# EAGLE schematic master-board plus slave (EAGLE 9.0.1)
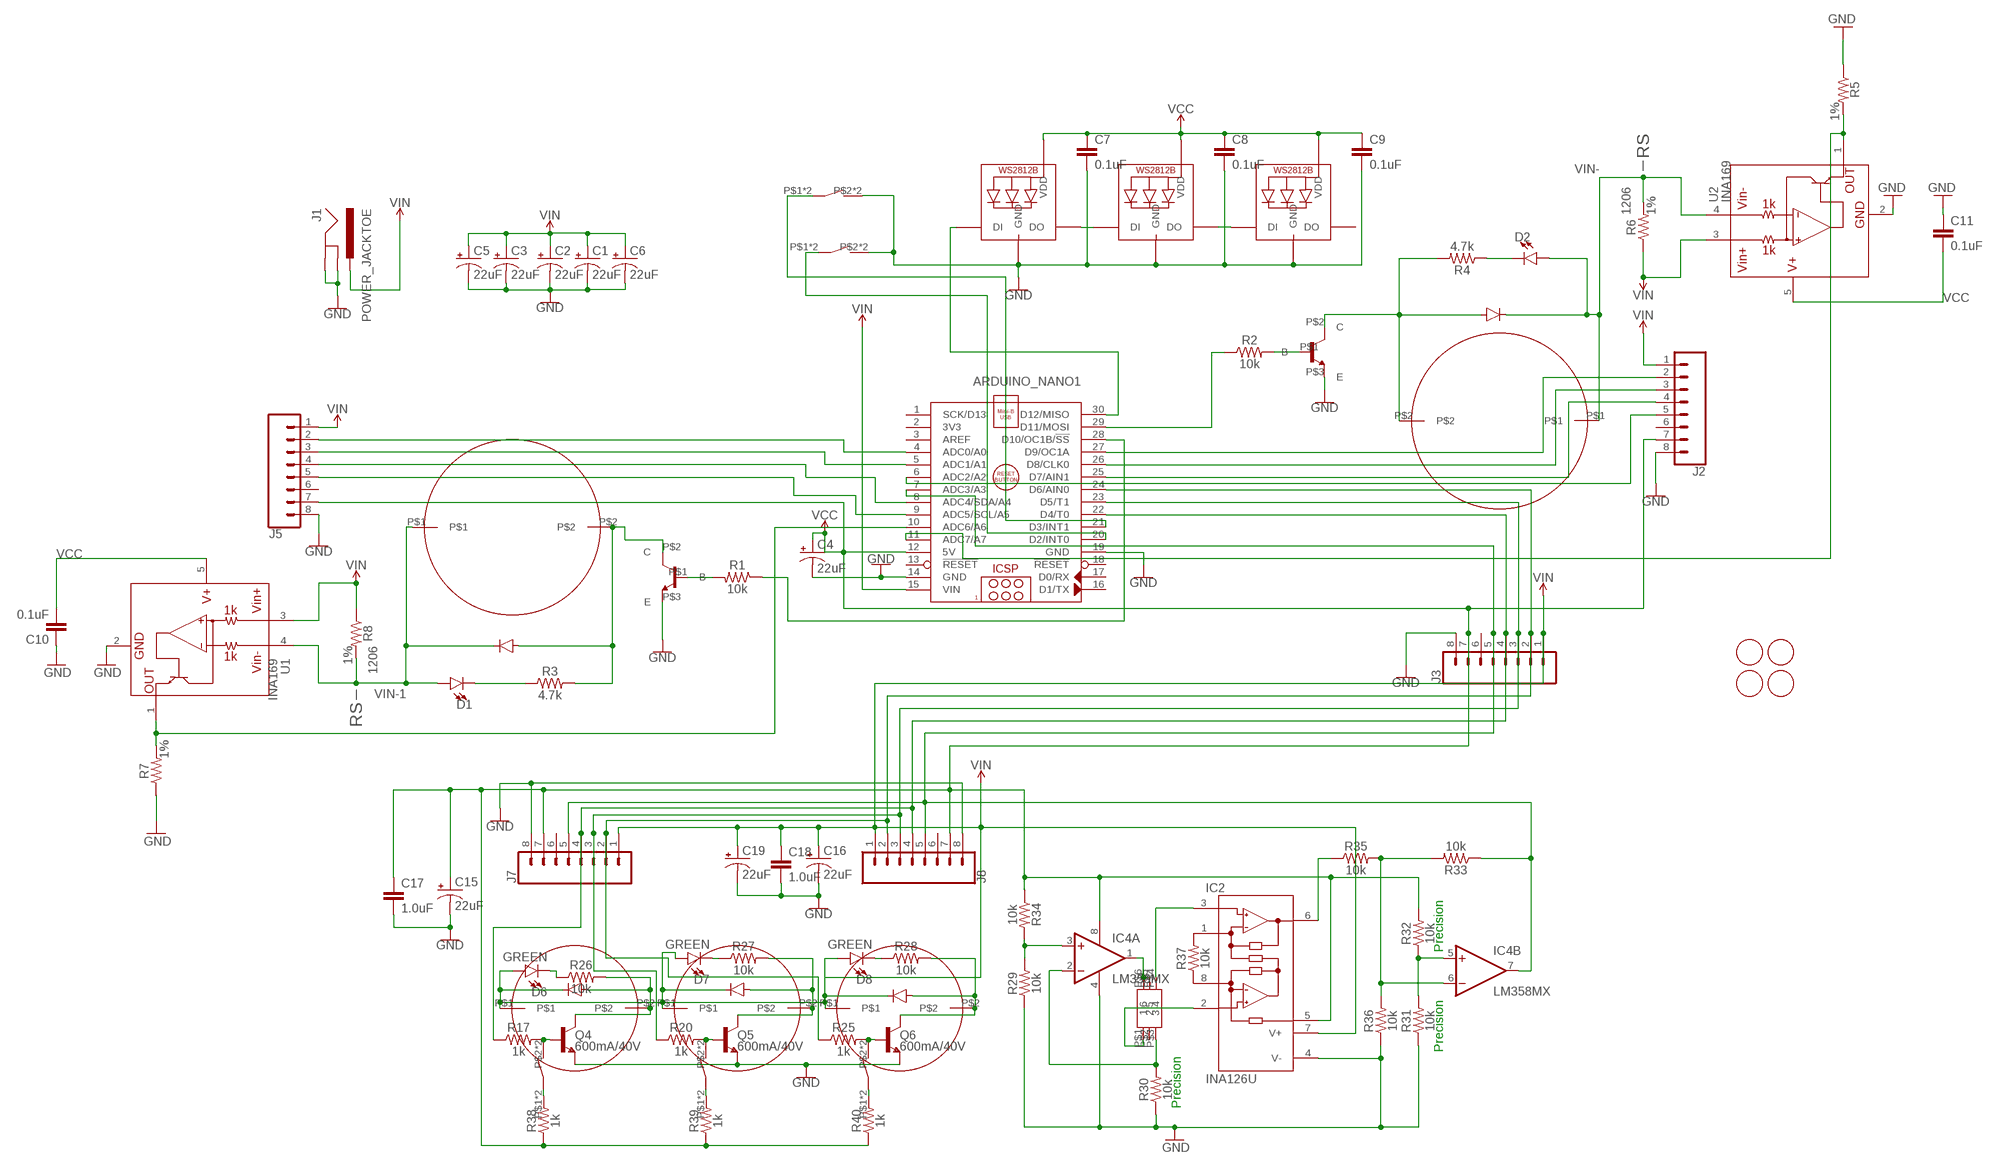
[diagram p0: schematic, sheet 1]

## Parts
ARDUINO_NANO1  ARDUINO_NANO  [ARDUINO_NANO]
C1  22uF  22UF-POLAR-PANASONIC_C-35V-20%  [PANASONIC_C]
C2  22uF  22UF-POLAR-PANASONIC_C-35V-20%  [PANASONIC_C]
C3  22uF  22UF-POLAR-PANASONIC_C-35V-20%  [PANASONIC_C]
C4  22uF  22UF-POLAR-PANASONIC_C-35V-20%  [PANASONIC_C]
C5  22uF  22UF-POLAR-PANASONIC_C-35V-20%  [PANASONIC_C]
C6  22uF  22UF-POLAR-PANASONIC_C-35V-20%  [PANASONIC_C]
C7  0.1uF  0.1UF-0603-25V-(+80/-20%)  [0603]
C8  0.1uF  0.1UF-0603-25V-(+80/-20%)  [0603]
C9  0.1uF  0.1UF-0603-25V-(+80/-20%)  [0603]
C10  0.1uF  CAP0603-CAP  [0603-CAP]
C11  0.1uF  CAP0603-CAP  [0603-CAP]
C15  22uF  22UF-POLAR-PANASONIC_C-35V-20%  [PANASONIC_C]
C16  22uF  22UF-POLAR-PANASONIC_C-35V-20%  [PANASONIC_C]
C17  1.0uF  1.0UF-0603-16V-10%  [0603]
C18  1.0uF  1.0UF-0603-16V-10%  [0603]
C19  22uF  22UF-POLAR-PANASONIC_C-35V-20%  [PANASONIC_C]
D1  LED0603  [LED-0603]
D2  LED0603  [LED-0603]
D6  GREEN  LED-GREEN0603  [LED-0603]
D7  GREEN  LED-GREEN0603  [LED-0603]
D8  GREEN  LED-GREEN0603  [LED-0603]
IC2  INA126U  [SO08]
IC4  LM358MX  [SO08]
J1  POWER_JACKTOE  [POWER_JACK_SMD_OVERPASTE_TOE]
J2  CONN_08"  [1X08]
J3  CONN_08"  [1X08]
J5  CONN_08"  [1X08]
J7  CONN_08"  [1X08]
J8  CONN_08"  [1X08]
LED1  WS2812B5050  [WS2812B]
LED2  WS2812B5050  [WS2812B]
LED3  WS2812B5050  [WS2812B]
Q4  600mA/40V  TRANS_NPN-MMBT2222AL  [SOT23-3]
Q5  600mA/40V  TRANS_NPN-MMBT2222AL  [SOT23-3]
Q6  600mA/40V  TRANS_NPN-MMBT2222AL  [SOT23-3]
R1  10k  10KOHM-0603-1/10W-1%  [0603]
R2  10k  10KOHM-0603-1/10W-1%  [0603]
R3  4.7k  4.7KOHM-0603-1/10W-1%  [0603]
R4  4.7k  4.7KOHM-0603-1/10W-1%  [0603]
R5  RESISTOR0603  [0603]
R6  RESISTOR1206  [1206]
R7  RESISTOR0603  [0603]
R8  RESISTOR1206  [1206]
R17  1k  1KOHM-0603-1/10W-1%  [0603]
R20  1k  1KOHM-0603-1/10W-1%  [0603]
R25  1k  1KOHM-0603-1/10W-1%  [0603]
R26  10k  10KOHM-0603-1/10W-1%  [0603]
R27  10k  10KOHM-0603-1/10W-1%  [0603]
R28  10k  10KOHM-0603-1/10W-1%  [0603]
R29  10k  10KOHM-0603-1/10W-1%  [0603]
R30  10k  10KOHM-0603-1/10W-1%  [0603]
R31  10k  10KOHM-0603-1/10W-1%  [0603]
R32  10k  10KOHM-0603-1/10W-1%  [0603]
R33  10k  10KOHM-0603-1/10W-1%  [0603]
R34  10k  10KOHM-0603-1/10W-1%  [0603]
R35  10k  10KOHM-0603-1/10W-1%  [0603]
R36  10k  10KOHM-0603-1/10W-1%  [0603]
R37  10k  10KOHM-0603-1/10W-1%  [0603]
R38  1k  1KOHM-0603-1/10W-1%  [0603]
R39  1k  1KOHM-0603-1/10W-1%  [0603]
R40  1k  1KOHM-0603-1/10W-1%  [0603]
U1  INA169  [SOT23-5]
U2  INA169  [SOT23-5]
U$1  AIYIMA-PUMP-A5F083  [A5F083]
U$2  AIYIMA-PUMP-A5F083  [A5F083]
U$3  IN4148  [IN4148]
U$4  IN4148  [IN4148]
U$5  TIP120-TO220  [TO220]
U$6  TIP120-TO220  [TO220]
U$7  BUTTON  [BUTTON]
U$8  BUTTON  [BUTTON]
U$9  FIDUCIAL  [FIDUCIAL_1MM]
U$10  FIDUCIAL  [FIDUCIAL_1MM]
U$11  FIDUCIAL  [FIDUCIAL_1MM]
U$12  FIDUCIAL  [FIDUCIAL_1MM]
U$17  CJV23-SOLENOID-VALVE  [CJV23]
U$18  CJV23-SOLENOID-VALVE  [CJV23]
U$19  CJV23-SOLENOID-VALVE  [CJV23]
U$20  IN4148  [IN4148]
U$21  IN4148  [IN4148]
U$22  IN4148  [IN4148]
U$23  2SMPP-03  [2SMPP-03]
U$24  BUTTON  [BUTTON]
U$25  BUTTON  [BUTTON]
U$26  BUTTON  [BUTTON]

## Nets
GND: ARDUINO_NANO1.14(GND) ARDUINO_NANO1.19(GND) C1.- C2.- C3.- C4.- C5.- C6.- C7.2 C8.2 C9.2 C10.1 C11.1 C15.- C16.- C17.2 C18.2 C19.- IC2.4(V-) IC4.4(P:V-) J1.GND(GNDBREAK) J1.P$4(GND) J2.8 J3.8 J5.8 J7.8 J8.8 LED1.3-GND(GND) LED2.3-GND(GND) LED3.3-GND(GND) Q4.2(E) Q5.2(E) Q6.2(E) R5.1 R7.1 R29.1 R30.1 R31.1 R36.1 U1.2(GND) U2.2(GND) U$5.P$3(E) U$6.P$3(E) U$7.P$2 U$7.P$4 U$8.P$2 U$8.P$4
N$1: ARDUINO_NANO1.29(D11/MOSI) R2.1
N$2: R1.2 U$6.P$1(B)
N$5: R3.2 U$1.P$2 U$3.P$2 U$6.P$2(C)
N$6: R4.2 U$2.P$2 U$4.P$2 U$5.P$2(C)
N$7: R2.2 U$5.P$1(B)
N$8: ARDUINO_NANO1.30(D12/MISO) LED1.4-DIN(DI)
N$10: ARDUINO_NANO1.28(D10/OC1B/!SS) R1.1
N$11: ARDUINO_NANO1.5(ADC1/A1) J5.3
N$12: D1.C R3.1
N$13: ARDUINO_NANO1.6(ADC2/A2) J2.5
N$14: ARDUINO_NANO1.9(ADC5/SCL/A5) J5.5
N$16: ARDUINO_NANO1.4(ADC0/A0) J5.2
N$17: D2.C R4.1
N$18: ARDUINO_NANO1.8(ADC4/SDA/A4) J5.4
N$20: ARDUINO_NANO1.20(D2/INT0) U$8.P$1 U$8.P$3
N$21: LED2.2-DOUT(DO) LED3.4-DIN(DI)
N$23: ARDUINO_NANO1.25(D7/AIN1) J2.4
N$24: ARDUINO_NANO1.26(D8/CLK0) J2.3
N$25: ARDUINO_NANO1.27(D9/OC1A) J2.2
N$26: LED1.2-DOUT(DO) LED2.4-DIN(DI)
N$29: ARDUINO_NANO1.21(D3/INT1) U$7.P$1 U$7.P$3
N$54: Q4.1(B) R17.2 U$24.P$2 U$24.P$4
N$55: Q5.1(B) R20.2 U$25.P$2 U$25.P$4
N$56: Q6.1(B) R25.2 U$26.P$2 U$26.P$4
N$57: Q6.3(C) R28.2 U$19.P$2 U$22.P$2
N$58: Q5.3(C) R27.2 U$18.P$2 U$21.P$2
N$59: Q4.3(C) R26.2 U$17.P$2 U$20.P$2
N$60: ARDUINO_NANO1.24(D6/AIN0) J3.2 J7.2 J8.2 R25.1
N$61: ARDUINO_NANO1.23(D5/T1) J3.3 J7.3 J8.3 R20.1
N$62: ARDUINO_NANO1.22(D4/T0) J3.4 J7.4 J8.4 R17.1
N$63: ARDUINO_NANO1.7(ADC3/A3) IC4.7(B:OUT) J3.5 J7.5 J8.5 R33.1
N$65: D8.C R28.1
N$66: D7.C R27.1
N$67: D6.C R26.1
N$68: IC2.2(-IN) U$23.P$1
N$69: IC4.1(A:OUT) U$23.P$5 U$23.P$6
N$70: IC2.3(+IN) U$23.P$4
N$71: IC4.3(A:+IN) R29.2 R34.2
N$72: IC2.8(RG) R37.1
N$73: IC2.1(RG) R37.2
N$74: IC4.6(B:-IN) R33.2 R35.2 R36.2
N$75: IC4.5(B:+IN) R31.2 R32.1
N$76: IC4.2(A:-IN) R30.2 U$23.P$3
N$77: IC2.6(OUT) R35.1
N$78: R38.2 U$24.P$1 U$24.P$3
N$79: R39.2 U$25.P$1 U$25.P$3
N$80: R40.2 U$26.P$1 U$26.P$3
VCC: ARDUINO_NANO1.12(5V) C4.+ C7.1 C8.1 C9.1 C10.2 C11.2 C15.+ C17.1 IC2.5(REF) IC4.8(P:V+) J2.7 J3.7 J5.7 J7.7 J8.7 LED1.1-VDD(VDD) LED2.1-VDD(VDD) LED3.1-VDD(VDD) R32.2 R34.1 R38.1 R39.1 R40.1 U1.5(V+) U2.5(V+)
VIN: ARDUINO_NANO1.15(VIN) C1.+ C2.+ C3.+ C5.+ C6.+ C16.+ C18.1 C19.+ D6.A D7.A D8.A IC2.7(V+) J1.VIN0(PWR) J2.1 J3.1 J5.1 J7.1 J8.1 R6.1 R8.1 U1.3(VIN+) U2.3(VIN+) U$17.P$1 U$18.P$1 U$19.P$1 U$20.P$1 U$21.P$1 U$22.P$1
VIN-: D2.A R6.2 U2.4(VIN-) U$2.P$1 U$4.P$1
VIN-1: D1.A R8.2 U1.4(VIN-) U$1.P$1 U$3.P$1
VOUT: ARDUINO_NANO1.10(ADC6/A6) R7.2 U1.1(OUT)
VOUT1: ARDUINO_NANO1.11(ADC7/A7) R5.2 U2.1(OUT)
Unconnected: ARDUINO_NANO1.1(SCK/D13) ARDUINO_NANO1.2(3V3) ARDUINO_NANO1.3(AREF) ARDUINO_NANO1.13(!RESET) ARDUINO_NANO1.16(D1/TX) ARDUINO_NANO1.17(D0/RX) ARDUINO_NANO1.18(!RESET) J2.6 J3.6 J5.6 J7.6 J8.6 LED3.2-DOUT(DO) U$23.P$2

## Notes on the sheet
- RS
- RS
- Precision
- Precision
- Precision

## Library data of the parts
ARDUINO_NANO1 = ArduinoNanoV30:ARDUINO_NANO: Arduino Nano V3.0 Module Overview: The Arduino Nano is a small, complete, and breadboard-friendly board based on the ATmega328 (Arduino Nano 3.x) or ATmega168 (Arduino Nano 2.x). It has more or less the same functionality of the Arduino Duemilanove, but in a different package. It lacks only a DC power jack, and works with a Mini-B USB cable instead of a standard one. The Nano was designed and is being produced by Gravitech <http://www.gravitech.us/arna30wiatp.html>. General specifications: Item Value Microcontroller Atmel ATmega168 or ATmega328 Operating Voltage (logic level) 5 V Input Voltage (recommended) 7-12 V Input Voltage (limits) 6-20 V Digital I/O Pins 14 (of which 6 provide PWM output) Analog Input Pins 8 DC Current per I/O Pin 40 mA Flash Memory 16 KB (ATmega168) or 32 KB (ATmega328) of which 2 KB used by bootloader SRAM 1 KB (ATmega168) or 2 KB (ATmega328) EEPROM 512 bytes (ATmega168) or 1 KB (ATmega328) Clock Speed 16 MHz Dimensions (Inches) 0.73" x 1.70" Dimensions (mm) 18mm x 45mm Overall height About 9 mm (not including pins) Weigth 5 g Power: The Arduino Nano can be powered via the Mini-B USB connection, 6-20V unregulated external power supply (pin 30), or 5V regulated external power supply (pin 27). The power source is automatically selected to the highest voltage source. Memory: The ATmega168 has 16 KB of flash memory for storing code (of which 2 KB is used for the bootloader); the ATmega328 has 32 KB, (also with 2 KB used for the bootloader). The ATmega168 has 1 KB of SRAM and 512 bytes of EEPROM (which can be read and written with the EEPROM library); the ATmega328 has 2 KB of SRAM and 1 KB of EEPROM. Input and Output: Each of the 14 digital pins on the Nano can be used as an input or output, using pinMode(), digitalWrite(), and digitalRead() functions. They operate at 5 volts. Each pin can provide or receive a maximum of 40 mA and has an internal pull-up resistor (disconnected by default) of 20-50 kOhms. In addition, some pins have specialized functions. Visit Arduino - ArduinoBoardNano <https://www.arduino.cc/en/Main/ArduinoBoardNano>
C1-C6 C15 C16 C19 = SparkFun-Capacitors:22UF-POLAR: 22µF polarized capacitors A capacitor is a passive two-terminal electrical component used to store electrical energy temporarily in an electric field.; PROD_ID: CAP-08618
C7-C9 = SparkFun-Capacitors:0.1UF: 0.1µF ceramic capacitors A capacitor is a passive two-terminal electrical component used to store electrical energy temporarily in an electric field.; PROD_ID: CAP-00810
C10 C11 = SparkFun-Passives:CAP: Capacitor Standard 0603 ceramic capacitor, and 0.1" leaded capacitor.
C17 C18 = SparkFun-Capacitors:1.0UF: 1µF ceramic capacitors A capacitor is a passive two-terminal electrical component used to store electrical energy temporarily in an electric field.; PROD_ID: CAP-00868
D1 D2 = SparkFun-LED:LED: LED (Generic) Standard schematic elements and footprints for 5mm, 3mm, 1206, and 0603 sized LEDs. Generic LEDs with no color specified.
D6-D8 = SparkFun-LED:LED-GREEN: Green SMD LED Used in manufacturing of various products at SparkFun Packages: 0603 - SMD 0603 package [Product Link] <http://www.futureelectronics.com/en/technologies/semiconductors/optoelectronics/leds/Pages/9894312-LTST-C190GKT.aspx?CrossPart=HSMG-C190&IM=0> LilyPad 1206 - SMD1206 LilyPad package [Product Link] <http://www.futureelectronics.com/en/Technologies/Product.aspx?ProductID=IN150NGHARVATEKCORPORATION2049943&IM=0> 1206 - SMD1206 package [Product Link] <http://www.futureelectronics.com/en/technologies/semiconductors/optoelectronics/leds/Pages/8315665-LTST-C150KGKT.aspx?IM=0> 1206 Bottom Mount -SMD 1206 Bottom Mount [Product Link] <http://www.digikey.com/product-detail/en/lite-on-inc/LTST-C230KGKT/160-1456-1-ND/386854> SparkFun Products: Pro Mini 328 -5V <https://www.sparkfun.com/products/821> RedBoard <https://www.sparkfun.com/products/12757> MP3 Trigger <https://www.sparkfun.com/products/13720> Makey Makey <https://www.sparkfun.com/products/11076>; PROD_ID: DIO-00821
IC2 = INA126:INA126: Instrumentation Amplifier Micropower, Single and Dual Versions; AVAILABILITY: Unavailable; DESCRIPTION: the ina126 and ina2126 are precision instrumentation amplifiers for accurate low noise differential signal acquisitio...; MF: Texas Instruments; MP: INA126; PACKAGE: TSSOP-8 Texas Instruments; PRICE: None
IC4 = linear:LM358: OP AMP also LM158; LM258; LM2904 Source: http://cache.national.com/ds/LM/LM158.pdf
J1 = SparkFun-Connectors:POWER_JACK: Power Jack Connector This is the standard 5.5mm barrel jack for power. The PTH is the most common, proven, reliable, footprint. The Slot footprint only works if the mill layer is transmitted to the PCB fab house so be warned. Here are the connectors we sell at SparkFun: DC Barrel Power Jack/Connector <https://www.sparkfun.com/products/119> (PRT-00119) DC Barrel Power Jack/Connector (SMD) <https://www.sparkfun.com/products/12748> (PRT-12748) DC Barrel Jack Adapter - Breadboard Compatible <https://www.sparkfun.com/products/10811> (PRT-10811) It is used on this SparkFun product (and many, many others): SparkFun RedBoard - Programmed with Arduino <https://www.sparkfun.com/products/12757> (DEV-12757) Also, if you need a mating power supply or connector, please check these out: Wall Adapter Power Supply - 9VDC 650mA <https://www.sparkfun.com/products/298> (TOL-00298) DC Barrel Jack Adapter - Male <https://www.sparkfun.com/products/10287> (PRT-10287); PROD_ID: CONN-08106; SF_ID: PRT-12748
J2 J3 J5 J7 J8 = SparkFun-Connectors:CONN_08: Multi connection point. Often used as Generic Header-pin footprint for 0.1 inch spaced/style header connections On any of the 0.1 inch spaced packages, you can populate with these: Break Away Headers - Straight <https://www.sparkfun.com/products/116> (PRT-00116) Break Away Male Headers - Right Angle <https://www.sparkfun.com/products/553> (PRT-00553) Female Headers <https://www.sparkfun.com/products/115> (PRT-00115) Break Away Headers - Machine Pin <https://www.sparkfun.com/products/117> (PRT-00117) Break Away Female Headers - Swiss Machine Pin <https://www.sparkfun.com/products/743> (PRT-00743) Arduino Stackable Header - 8 Pin <https://www.sparkfun.com/products/9279> (PRT-09279) For SCREWTERMINALS and SPRING TERMINALS visit here: Screw Terimnals on SparkFun.com <https://www.sparkfun.com/search/results?term=Screw+Terminals> (5mm/3.5mm/2.54mm spacing) This device is also useful as a general connection point to wire up your design to another part of your project. Our various solder wires solder well into these plated through hole pads. Hook-Up Wire - Assortment (Stranded, 22 AWG) <https://www.sparkfun.com/products/11375> (PRT-11375) Hook-Up Wire - Assortment (Solid Core, 22 AWG) <https://www.sparkfun.com/products/11367> (PRT-11367) View the entire wire category on our website here <https://www.sparkfun.com/categories/141> Special notes: Molex polarized connector foot print use with SKU : PRT-08231 with associated crimp pins and housings. 1MM SMD Version SKU: PRT-10208 NOTES ON THE VARIANTS LOCK and LOCK_LONGPADS... This footprint was designed to help hold the alignment of a through-hole component (i.e. 6-pin header) while soldering it into place. You may notice that each hole has been shifted either up or down by 0.005 of an inch from it's more standard position (which is a perfectly straight line). This slight alteration caused the pins (the squares in the middle) to touch the edges of the holes. Because they are alternating, it causes a "brace" to hold the component in place. 0.005 has proven to be the perfect amount of "off-center" position when using our standard breakaway headers. Although looks a little odd when you look at the bare footprint, once you have a header in there, the alteration is very hard to notice. Also,if you push a header all the way into place, it is covered up entirely on the bottom side.; PROD_ID: CONN-08438
LED1-LED3 = adafruit:WS2812B
Q4-Q6 = SparkFun-DiscreteSemi:TRANS_NPN: NPN transistor Current controlled devices typically used to amplify current or used as a switch. BC547 - COM-08928 <http://www.sparkfun.com/products/8928> (TO-92 45V 100mA) (1.Collector 2.Base 3.Emitter) 2N3904 - COM-00521 <http://www.sparkfun.com/products/521> (TO-92 40V 200mA) (1.Emitter 2.Base 3.Collector) P2N2222A - COM-12852 <http://www.sparkfun.com/products/12852> (TO-92 40V 600mA) (1.Collector 2.Base 3.Emitter); PROD_ID: TRANS-08049
R1 R2 R26-R37 = SparkFun-Resistors:10KOHM: 10kΩ resistor A resistor is a passive two-terminal electrical component that implements electrical resistance as a circuit element. Resistors act to reduce current flow, and, at the same time, act to lower voltage levels within circuits. - Wikipedia; PROD_ID: RES-00824
R3 R4 = SparkFun-Resistors:4.7KOHM: 4.7kΩ resistor A resistor is a passive two-terminal electrical component that implements electrical resistance as a circuit element. Resistors act to reduce current flow, and, at the same time, act to lower voltage levels within circuits. - Wikipedia; PROD_ID: RES-07857
R5 R7 = SparkFun-Resistors:RESISTOR: Generic Resistor Package; TOL: 1%
R6 R8 = SparkFun-Resistors:RESISTOR: Generic Resistor Package; SIZE: 1206; TOL: 1%
R17 R20 R25 R38-R40 = SparkFun-Resistors:1KOHM: 1kΩ resistor A resistor is a passive two-terminal electrical component that implements electrical resistance as a circuit element. Resistors act to reduce current flow, and, at the same time, act to lower voltage levels within circuits. - Wikipedia; PROD_ID: RES-07856
U1 U2 = SparkFun-AnalogIC:INA169
U$1 U$2 = programmable-air-components:AIYIMA-PUMP-A5F083: Aiyima company vacuum/high pressure air pump. 12V, 0.35A, 3LPM
U$3 U$4 U$20-U$22 = programmable-air-components:IN4148
U$5 U$6 = programmable-air-components:TIP120-TO220
U$7 U$8 U$24-U$26 = programmable-air-components:BUTTON
U$9-U$12 = adafruit:FIDUCIAL: For use by pick and place machines to calibrate the vision/machine, 1mm By microbuilder.eu
U$17-U$19 = programmable-air-components:CJV23-SOLENOID-VALVE: CJV23 solenoid valve
U$23 = programmable-air-components:2SMPP-03